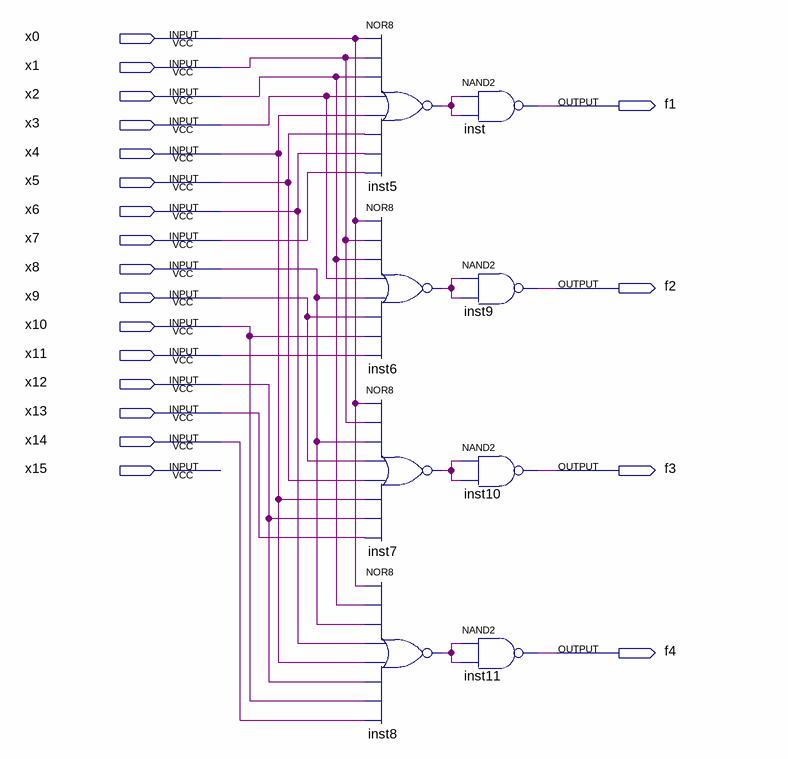
[diagram p0: schematic sheet]
// Quartus schematic z1.bdf as structural Verilog: 8 symbols, 20 pins
module z1 (
  input  x0,
  input  x1,
  input  x2,
  input  x3,
  input  x4,
  input  x5,
  input  x6,
  input  x7,
  input  x8,
  input  x9,
  input  x10,
  input  x11,
  input  x12,
  input  x13,
  input  x14,
  input  x15,
  output f1,
  output f2,
  output f3,
  output f4
);

  wire inst5_out, inst6_out, inst7_out, inst8_out;

  nor inst5 (inst5_out, x0, x1, x2, x3, x4, x5, x6, x7);
  nor inst6 (inst6_out, x0, x1, x2, x3, x8, x9, x10, x11);
  nor inst7 (inst7_out, x0, x1, x8, x9, x5, x4, x12, x13);
  nor inst8 (inst8_out, x0, x2, x8, x6, x4, x12, x10, x14);
  nand inst (f1, inst5_out, inst5_out);
  nand inst9 (f2, inst6_out, inst6_out);
  nand inst10 (f3, inst7_out, inst7_out);
  nand inst11 (f4, inst8_out, inst8_out);
endmodule
